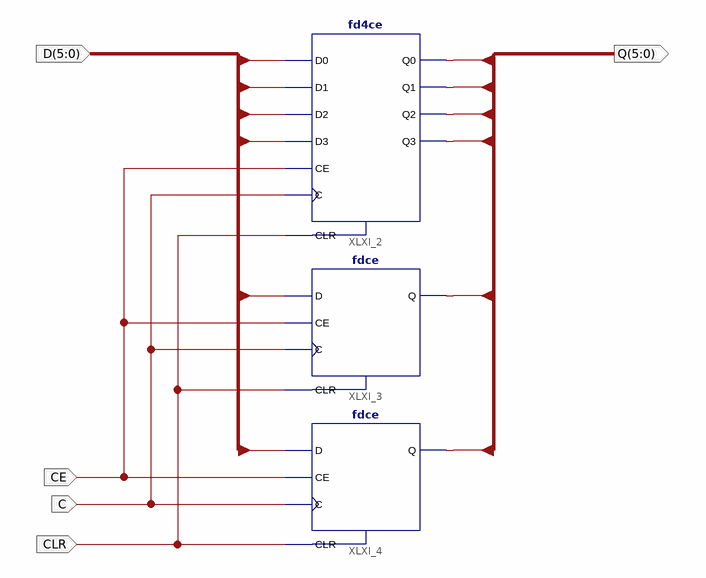
[diagram p0: schematic sheet 1]
// Xilinx ISE schematic fd6ce.sch (xc9500xl) as structural Verilog: 3 symbols, 5 ports
module fd6ce (
  input  CLR,
  input  C,
  input  CE,
  input  [5:0] D,
  output [5:0] Q
);

  fd4ce XLXI_2 (
    .C(C), .CE(CE), .CLR(CLR), .D0(D[0]), .D1(D[1]), .D2(D[2]), .D3(D[3]), .Q0(Q[0]), .Q1(Q[1]), .Q2(Q[2]),
    .Q3(Q[3]));
  fdce XLXI_3 (.C(C), .CE(CE), .CLR(CLR), .D(D[4]), .Q(Q[4]));
  fdce XLXI_4 (.C(C), .CE(CE), .CLR(CLR), .D(D[5]), .Q(Q[5]));
endmodule
